# EAGLE design PT08 (EAGLE 6.6.0)

## Sheet 1 of 2
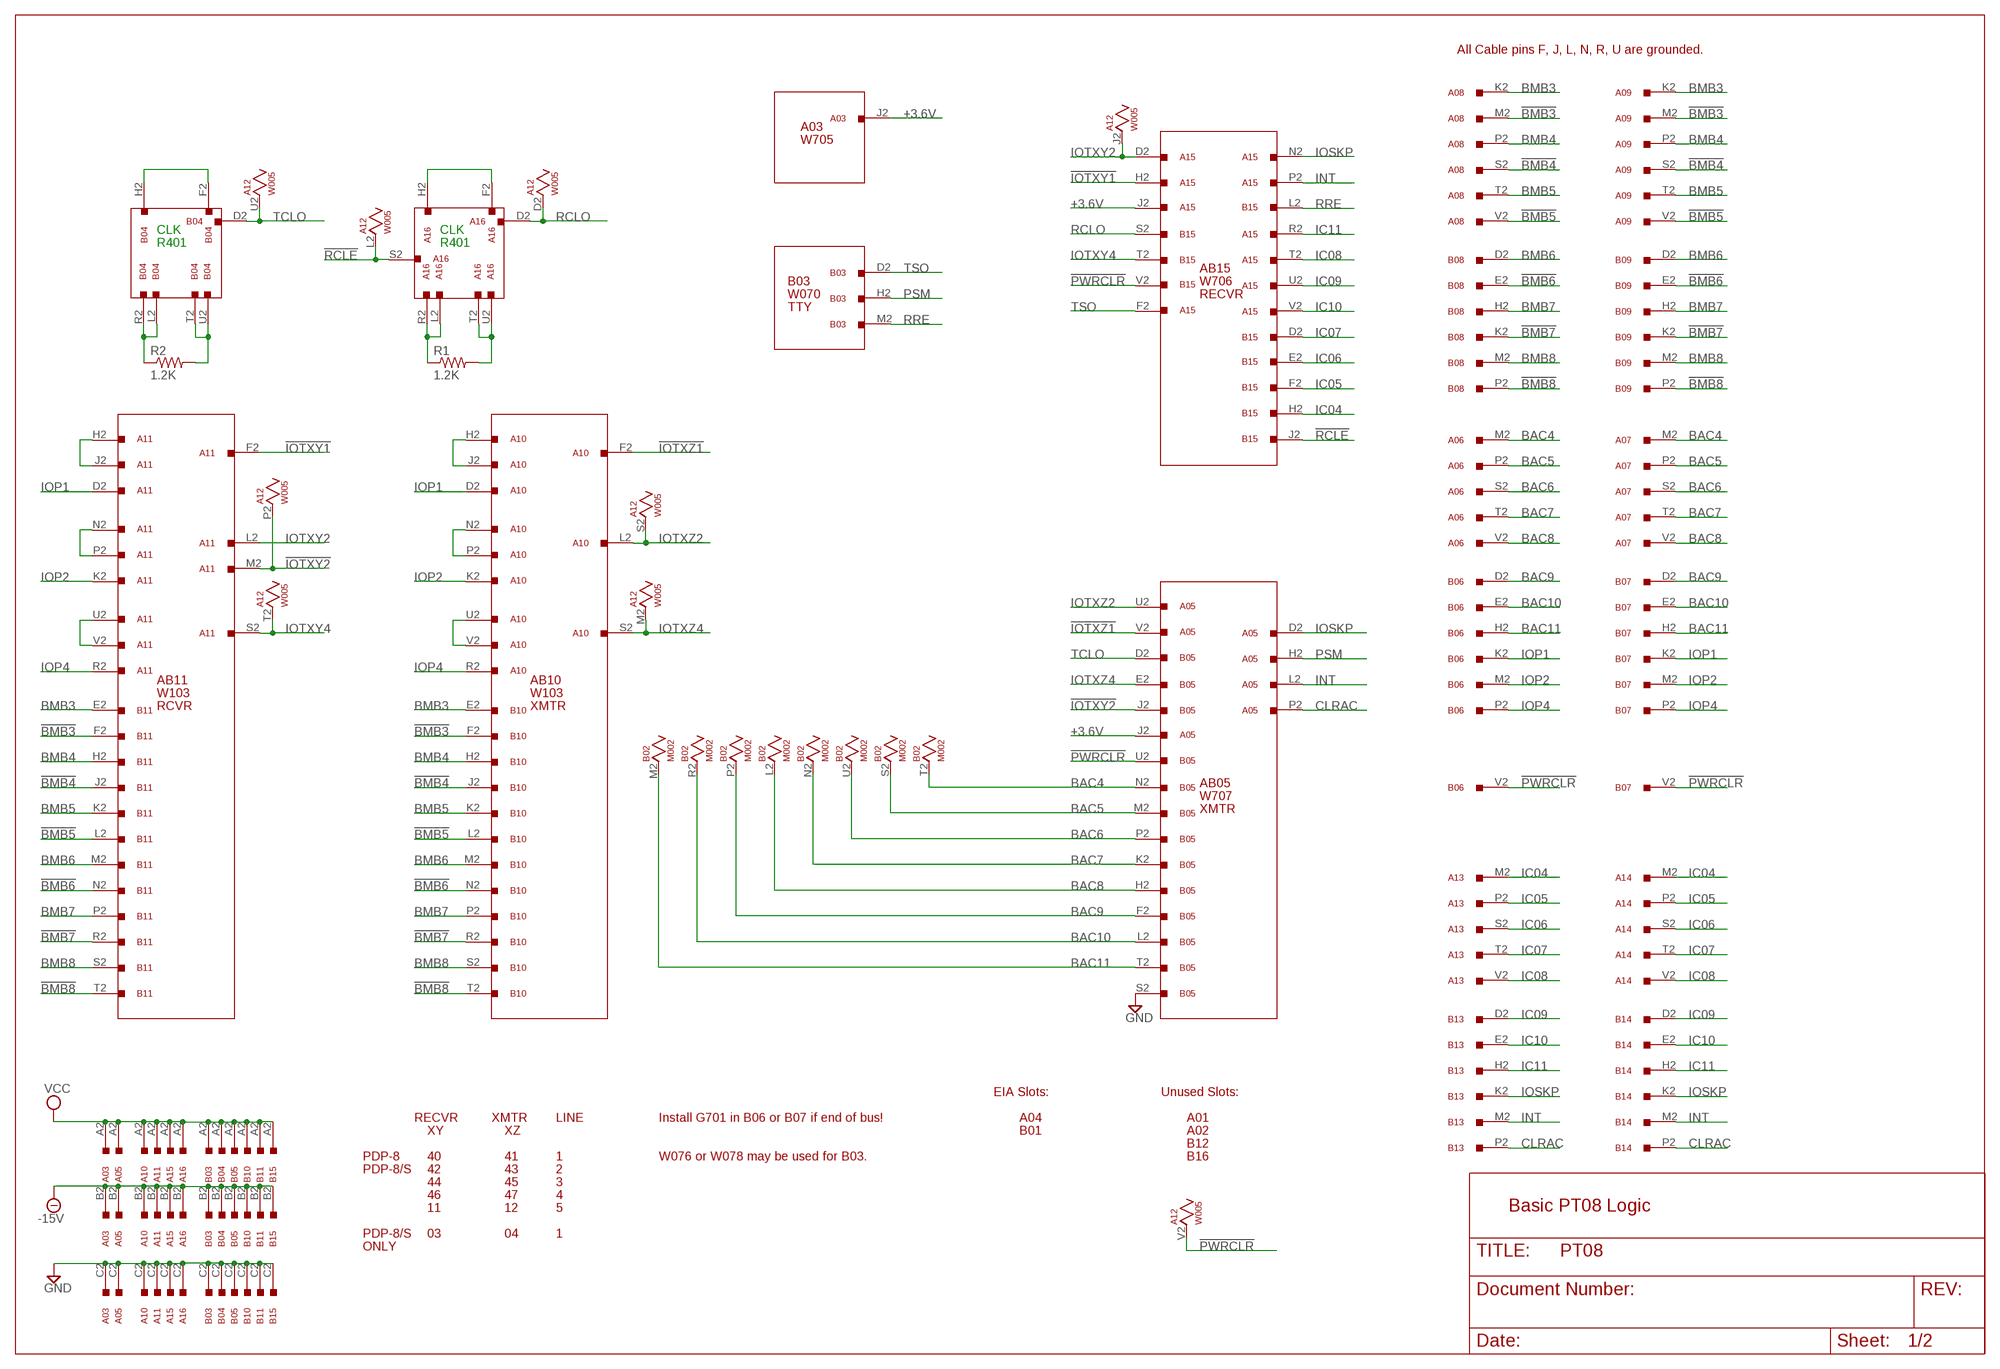
[diagram p0: schematic, sheet 1]

### Parts
A01  H807  [H807]
A02  H807  [H807]
A03  W705  W023  [H807]
A05  W707  W023  [H807]
A06  W011  [H807]
A07  W011  [H807]
A08  W011  [H807]
A09  W011  [H807]
A10  W103  W023  [H807]
A11  W103  W023  [H807]
A12  W005  [H807]
A13  W011  [H807]
A14  W011  [H807]
A15  W706  W023  [H807]
A16  R401  W023  [H807]
B02  M002  [H807]
B03  W076  W023  [H807]
B04  R401  W023  [H807]
B05  W707  W023  [H807]
B06  W011  [H807]
B07  W011  [H807]
B08  W011  [H807]
B09  W011  [H807]
B10  W103  W023  [H807]
B11  W103  W023  [H807]
B12  H807  [H807]
B13  W011  [H807]
B14  W011  [H807]
B15  W706  W023  [H807]
B16  H807  [H807]
R1  1.2K  R-US_0207/10  [0207/10]
R2  1.2K  R-US_0207/10  [0207/10]

### Nets
!BMB3: A08.M2 A09.M2 B10.F2 B11.F2
!BMB4: A08.S2 A09.S2 B10.J2 B11.J2
!BMB5: A08.V2 A09.V2 B10.L2 B11.L2
!BMB6: B08.E2 B09.E2 B10.N2 B11.N2
!BMB7: B08.K2 B09.K2 B10.R2 B11.R2
!BMB8: B08.P2 B09.P2 B10.T2 B11.T2
!IOTXY1: A11.F2 A15.H2
!IOTXY2: A11.M2 A12.P2 B05.J2
!IOTXZ1: A05.V2 A10.F2
!PWRCLR: A12.V2 B05.U2 B06.V2 B07.V2 B15.V2
!RCLE: A12.L2 A16.S2 B15.J2
+3.6V: A03.J2 A05.J2 A15.J2
-15V [Power]: A03.B2 A05.B2 A10.B2 A11.B2 A15.B2 A16.B2 B03.B2 B04.B2 B05.B2 B10.B2 B11.B2 B15.B2 ; also sheet 2
BAC4: A06.M2 A07.M2 B02.T2 B05.N2
BAC5: A06.P2 A07.P2 B02.S2 B05.M2
BAC6: A06.S2 A07.S2 B02.U2 B05.P2
BAC7: A06.T2 A07.T2 B02.N2 B05.K2
BAC8: A06.V2 A07.V2 B02.L2 B05.H2
BAC9: B02.P2 B05.F2 B06.D2 B07.D2
BAC10: B02.R2 B05.L2 B06.E2 B07.E2
BAC11: B02.M2 B05.T2 B06.H2 B07.H2
BMB3: A08.K2 A09.K2 B10.E2 B11.E2
BMB4: A08.P2 A09.P2 B10.H2 B11.H2
BMB5: A08.T2 A09.T2 B10.K2 B11.K2
BMB6: B08.D2 B09.D2 B10.M2 B11.M2
BMB7: B08.H2 B09.H2 B10.P2 B11.P2
BMB8: B08.M2 B09.M2 B10.S2 B11.S2
CLRAC: A05.P2 B13.P2 B14.P2
GND [Power]: A03.C2 A05.C2 A10.C2 A11.C2 A15.C2 A16.C2 B03.C2 B04.C2 B05.C2 B05.S2 B10.C2 B11.C2 B15.C2 ; also sheet 2
IC04: A13.M2 A14.M2 B15.H2
IC05: A13.P2 A14.P2 B15.F2
IC06: A13.S2 A14.S2 B15.E2
IC07: A13.T2 A14.T2 B15.D2
IC08: A13.V2 A14.V2 A15.T2
IC09: A15.U2 B13.D2 B14.D2
IC10: A15.V2 B13.E2 B14.E2
IC11: A15.R2 B13.H2 B14.H2
INT: A05.L2 A15.P2 B13.M2 B14.M2
IOP1: A10.D2 A11.D2 B06.K2 B07.K2
IOP2: A10.K2 A11.K2 B06.M2 B07.M2
IOP4: A10.R2 A11.R2 B06.P2 B07.P2
IOSKP: A05.D2 A15.N2 B13.K2 B14.K2
IOTXY2: A11.L2 A12.J2 A15.D2
IOTXY4: A11.S2 A12.T2 B15.T2
IOTXZ2: A05.U2 A10.L2 A12.S2
IOTXZ4: A10.S2 A12.M2 B05.E2
N$1: A10.U2 A10.V2
N$2: A16.F2 A16.H2
N$3: A16.L2 A16.R2 R1.1
N$4: A16.T2 A16.U2 R1.2
N$5: A10.H2 A10.J2
N$6: B04.F2 B04.H2
N$7: B04.L2 B04.R2 R2.1
N$8: B04.T2 B04.U2 R2.2
N$9: A11.U2 A11.V2
N$10: A11.H2 A11.J2
N$11: A10.N2 A10.P2
N$12: A11.N2 A11.P2
PSM: A05.H2 B03.H2 ; also sheet 2
RCLO: A12.D2 A16.D2 B15.S2
RRE: B03.M2 B15.L2
TCLO: A12.U2 B04.D2 B05.D2
TSO: A15.F2 B03.D2 ; also sheet 2
VCC [Power]: A03.A2 A05.A2 A10.A2 A11.A2 A15.A2 A16.A2 B03.A2 B04.A2 B05.A2 B10.A2 B11.A2 B15.A2 ; also sheet 2
Unconnected: A03.D2 A03.E2 A03.F2 A03.H2 A03.K2 A03.L2 A03.M2 A03.N2 A03.P2 A03.R2 A03.S2 A03.T2 A03.U2 A03.V2 A05.E2 A05.F2 A05.K2 A05.M2 A05.N2 A05.R2 A05.S2 A05.T2 A06.D2 A06.E2 A06.H2 A06.K2 A07.D2 A07.E2 A07.H2 A07.K2 A08.D2 A08.E2 A08.H2 A09.D2 A09.E2 A09.H2 A10.E2 A10.M2 A10.T2 A11.E2 A11.T2 A12.E2 A12.F2 A12.H2 A12.K2 A12.N2 A12.R2 A13.D2 A13.E2 A13.H2 A13.K2 A14.D2 A14.E2 A14.H2 A14.K2 A15.E2 A15.K2 A15.L2 A15.M2 A15.S2 A16.E2 A16.J2 A16.K2 A16.M2 A16.N2 A16.P2 A16.V2 B02.F2 B02.H2 B02.J2 B02.K2 B02.V2 B03.F2 B03.J2 B03.L2 B03.N2 B03.R2 B03.S2 B03.T2 B03.U2 B03.V2 B04.E2 B04.J2 B04.K2 B04.M2 B04.N2 B04.P2 B04.S2 B04.V2 B05.R2 B05.V2 B06.S2 B06.T2 B07.S2 B07.T2 B08.S2 B08.T2 B08.V2 B09.S2 B09.T2 B09.V2 B10.D2 B10.U2 B10.V2 B11.D2 B11.U2 B11.V2 B13.S2 B13.T2 B13.V2 B14.S2 B14.T2 B14.V2 B15.K2 B15.M2 B15.N2 B15.P2 B15.R2 B15.U2

### Notes on the sheet
- All Cable pins F, J, L, N, R, U are grounded.
- A03
- W705
- CLK | CLK
- R401 | R401
- AB15
- B03 | W706
- W070 | RECVR
- TTY
- AB11 | AB10
- W103 | W103
- RCVR | XMTR
- AB05
- W707
- XMTR
- EIA Slots: | Unused Slots:
- RECVR | XMTR | LINE | Install G701 in B06 or B07 if end of bus! | A04
- XY | XZ | B01
- PDP-8 | 40 | 41 | 1 | W076 or W078 may be used for B03.
- PDP-8/S | 42 | 43 | 2
- 44 | 45 | 3
- 46 | 47 | 4
- 11 | 12 | 5 | Basic PT08 Logic
- PDP-8/S | 03 | 04 | 1
- ONLY

## Sheet 2 of 2
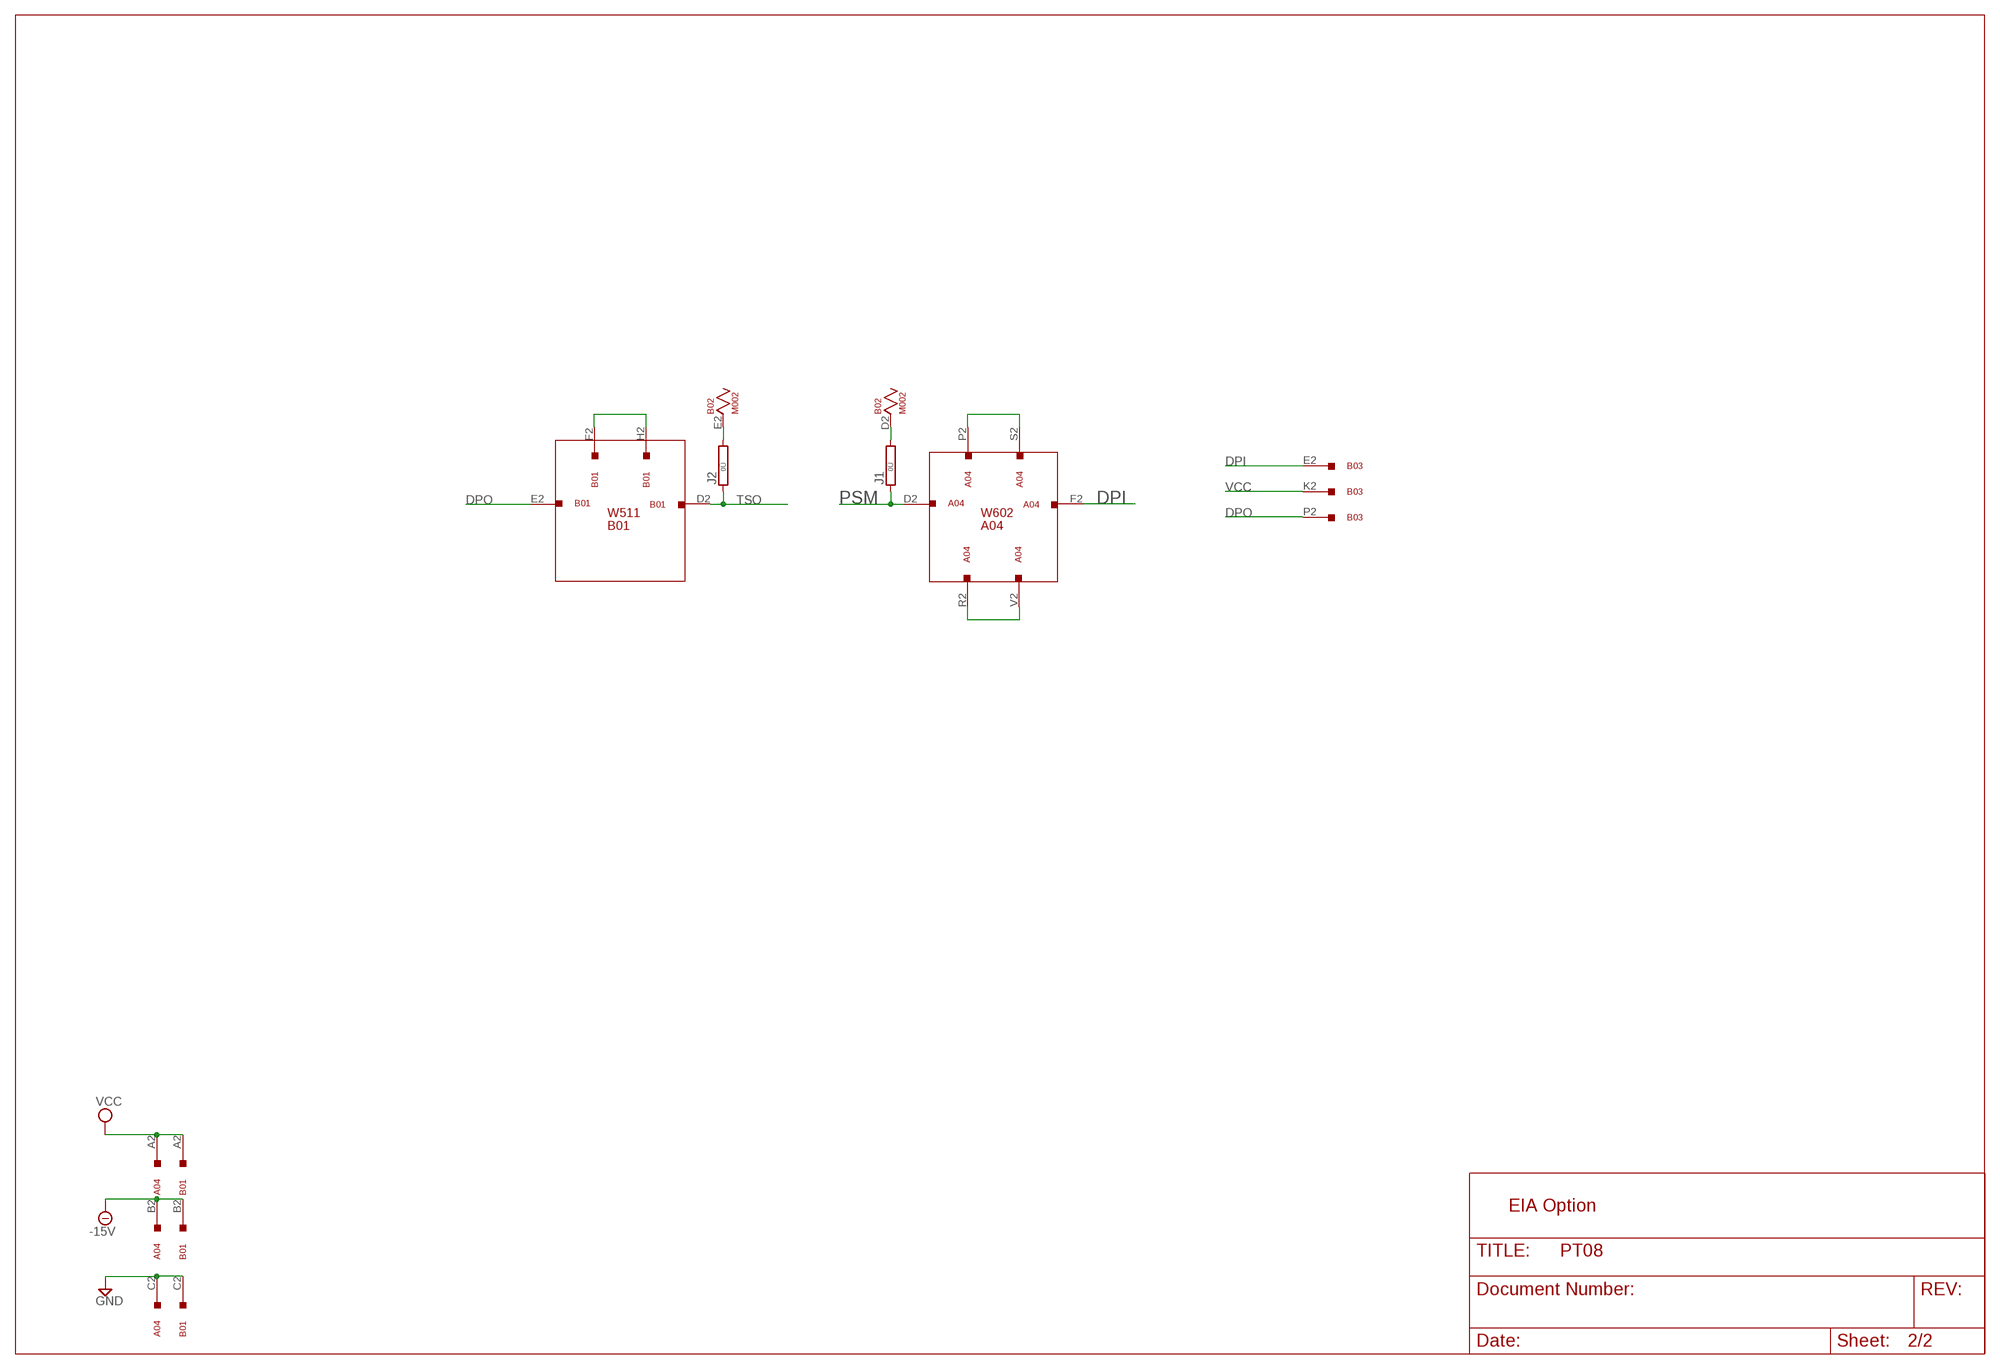
[diagram p1: schematic, sheet 2]

### Parts
A04  W602  W023  [H807]
B01  W511  W023  [H807]
J1  0R  [0R/10]
J2  0R  [0R/10]

### Nets
-15V [Power]: A04.B2 B01.B2 ; also sheet 1
DPI: A04.F2 B03.E2
DPO: B01.E2 B03.P2
GND [Power]: A04.C2 B01.C2 ; also sheet 1
N$13: A04.P2 A04.S2
N$14: A04.R2 A04.V2
N$15: B02.D2 J1.2
N$16: B01.F2 B01.H2
N$17: B02.E2 J2.2
PSM: A04.D2 J1.1 ; also sheet 1
TSO: B01.D2 J2.1 ; also sheet 1
VCC [Power]: A04.A2 B01.A2 B03.K2 ; also sheet 1
Unconnected: A04.E2 A04.H2 A04.J2 A04.K2 A04.L2 A04.M2 A04.N2 A04.T2 A04.U2 B01.J2 B01.K2 B01.L2 B01.M2 B01.N2 B01.P2 B01.R2 B01.S2 B01.T2 B01.U2 B01.V2

### Notes on the sheet
- W511 | W602
- B01 | A04
- EIA Option

## Power pins joined to a net without a drawn wire
-15V: A12.B2(-15V)
GND: A06.C2 A06.F2 A06.J2 A06.L2 A06.N2 A06.R2 A06.U2 A07.C2 A07.F2 A07.J2 A07.L2 A07.N2 A07.R2 A07.U2 A08.C2 A08.F2 A08.J2 A08.L2 A08.N2 A08.R2 A08.U2 A09.C2 A09.F2 A09.J2 A09.L2 A09.N2 A09.R2 A09.U2 A12.C2(GND) A13.C2 A13.F2 A13.J2 A13.L2 A13.N2 A13.R2 A13.U2 A14.C2 A14.F2 A14.J2 A14.L2 A14.N2 A14.R2 A14.U2 B02.C2(GND) B06.C2 B06.F2 B06.J2 B06.L2 B06.N2 B06.R2 B06.U2 B07.C2 B07.F2 B07.J2 B07.L2 B07.N2 B07.R2 B07.U2 B08.C2 B08.F2 B08.J2 B08.L2 B08.N2 B08.R2 B08.U2 B09.C2 B09.F2 B09.J2 B09.L2 B09.N2 B09.R2 B09.U2 B13.C2 B13.F2 B13.J2 B13.L2 B13.N2 B13.R2 B13.U2 B14.C2 B14.F2 B14.J2 B14.L2 B14.N2 B14.R2 B14.U2
VCC: A12.A2(VCC) B02.A2(VCC)

## Library data of the parts
A01 A02 B12 B16 = dec-m:H807: Empty card slot
A03-A05 A10 A11 A15 A16 B01 B03-B05 B10 B11 B15 = dec-m:W023: One-sided 18 pin connector/cable.
A06-A09 A13 A14 B06-B09 B13 B14 = dec-m:W011: One-sided 9 pin connector/cable with grounds (Negibus).
A12 = dec-m:W005: 15 Clamped Loads
B02 = dec-m:M002: 15 Clamped Loads
J1 J2 = jumper:0R: Bridge 0R 10mm
R1 R2 = rcl:R-US_: RESISTOR, American symbol

## Net classes
1 Power: width 0.508 mm

## Board
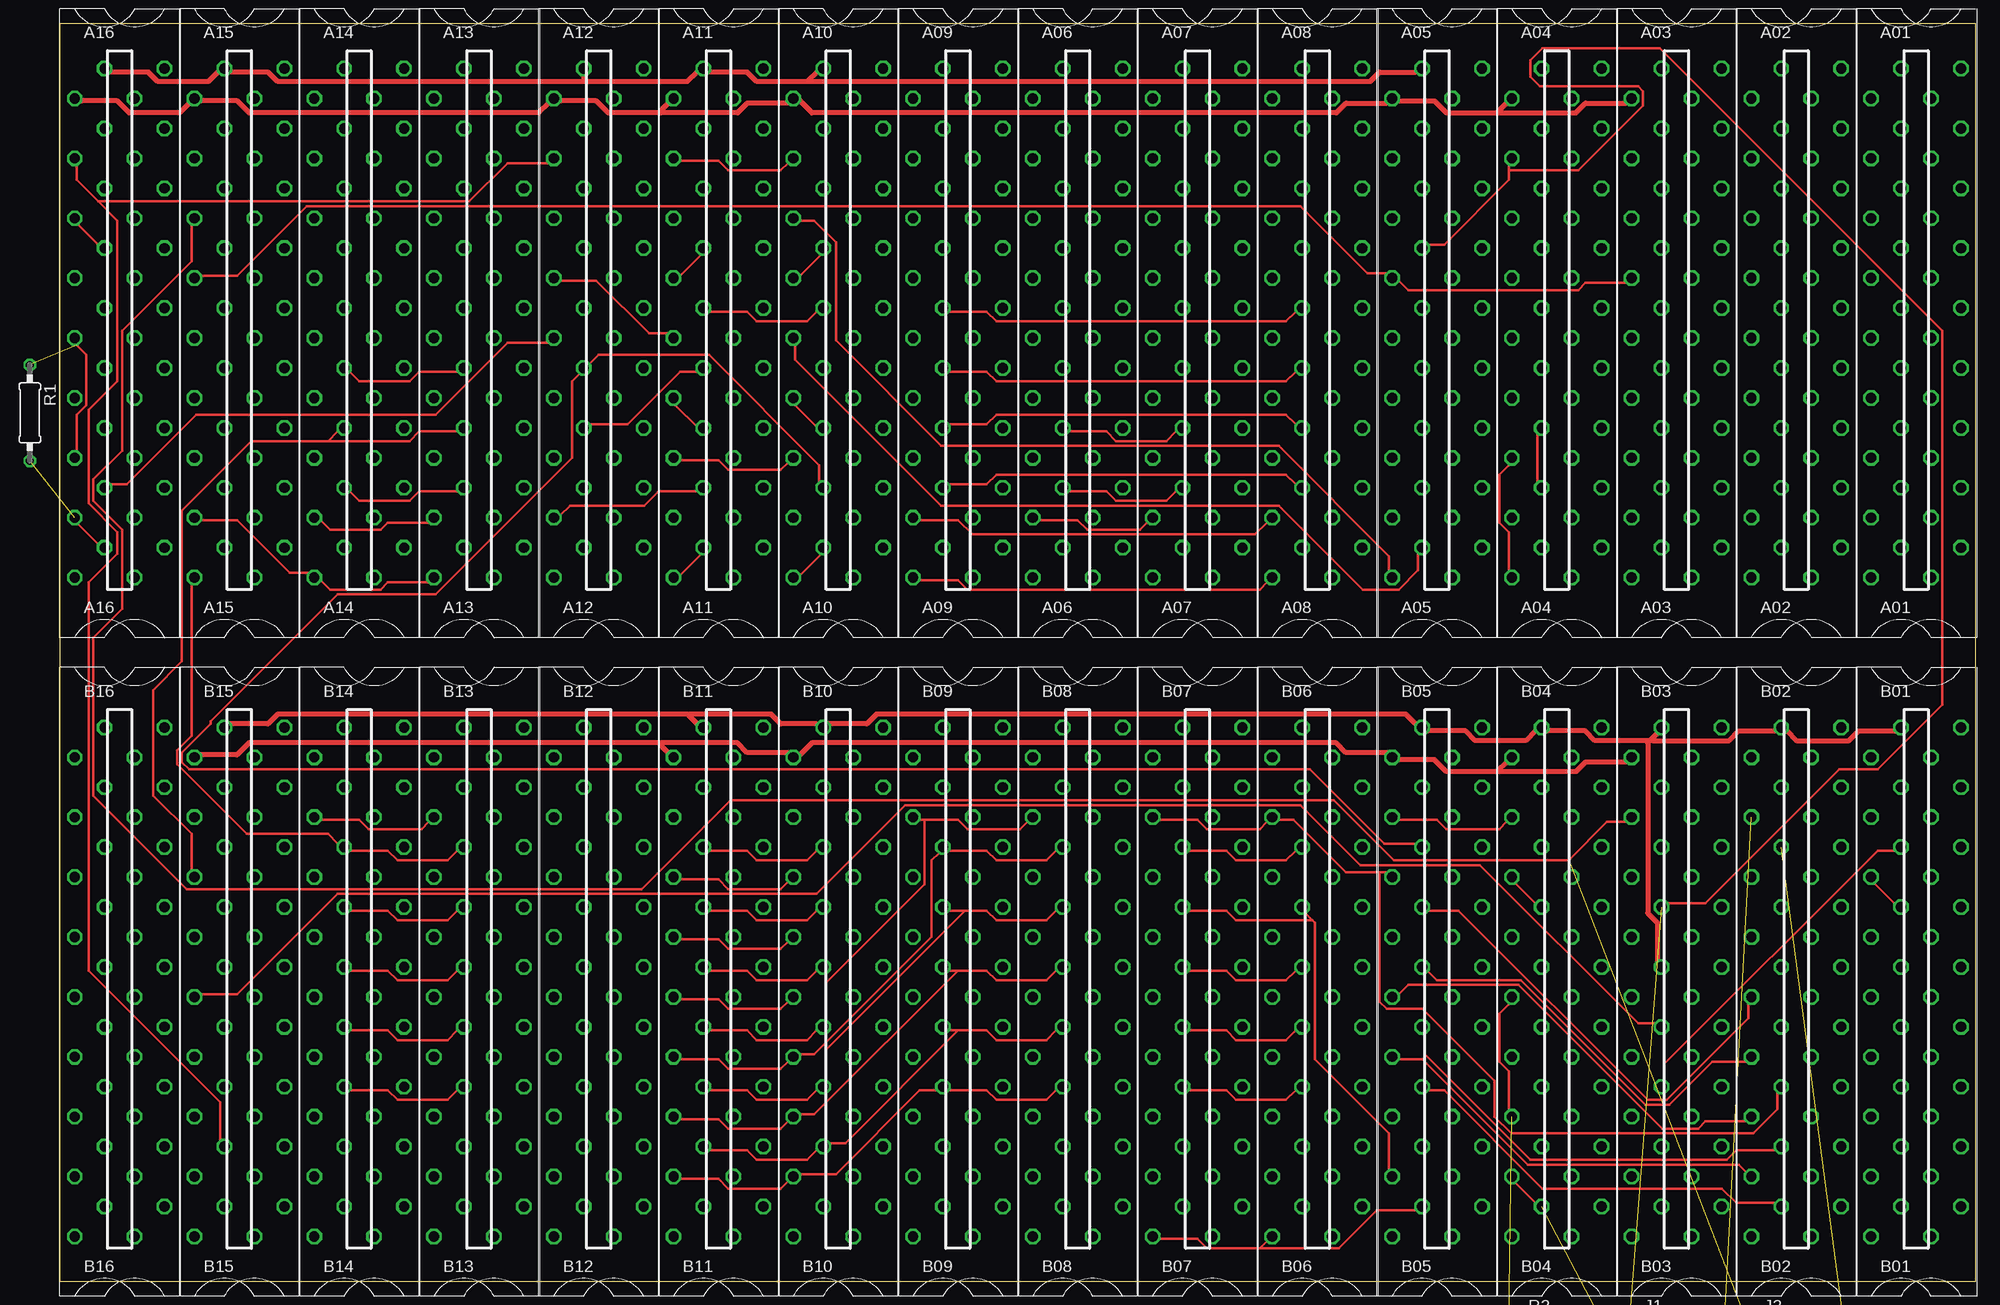
[diagram p2: board, top side]
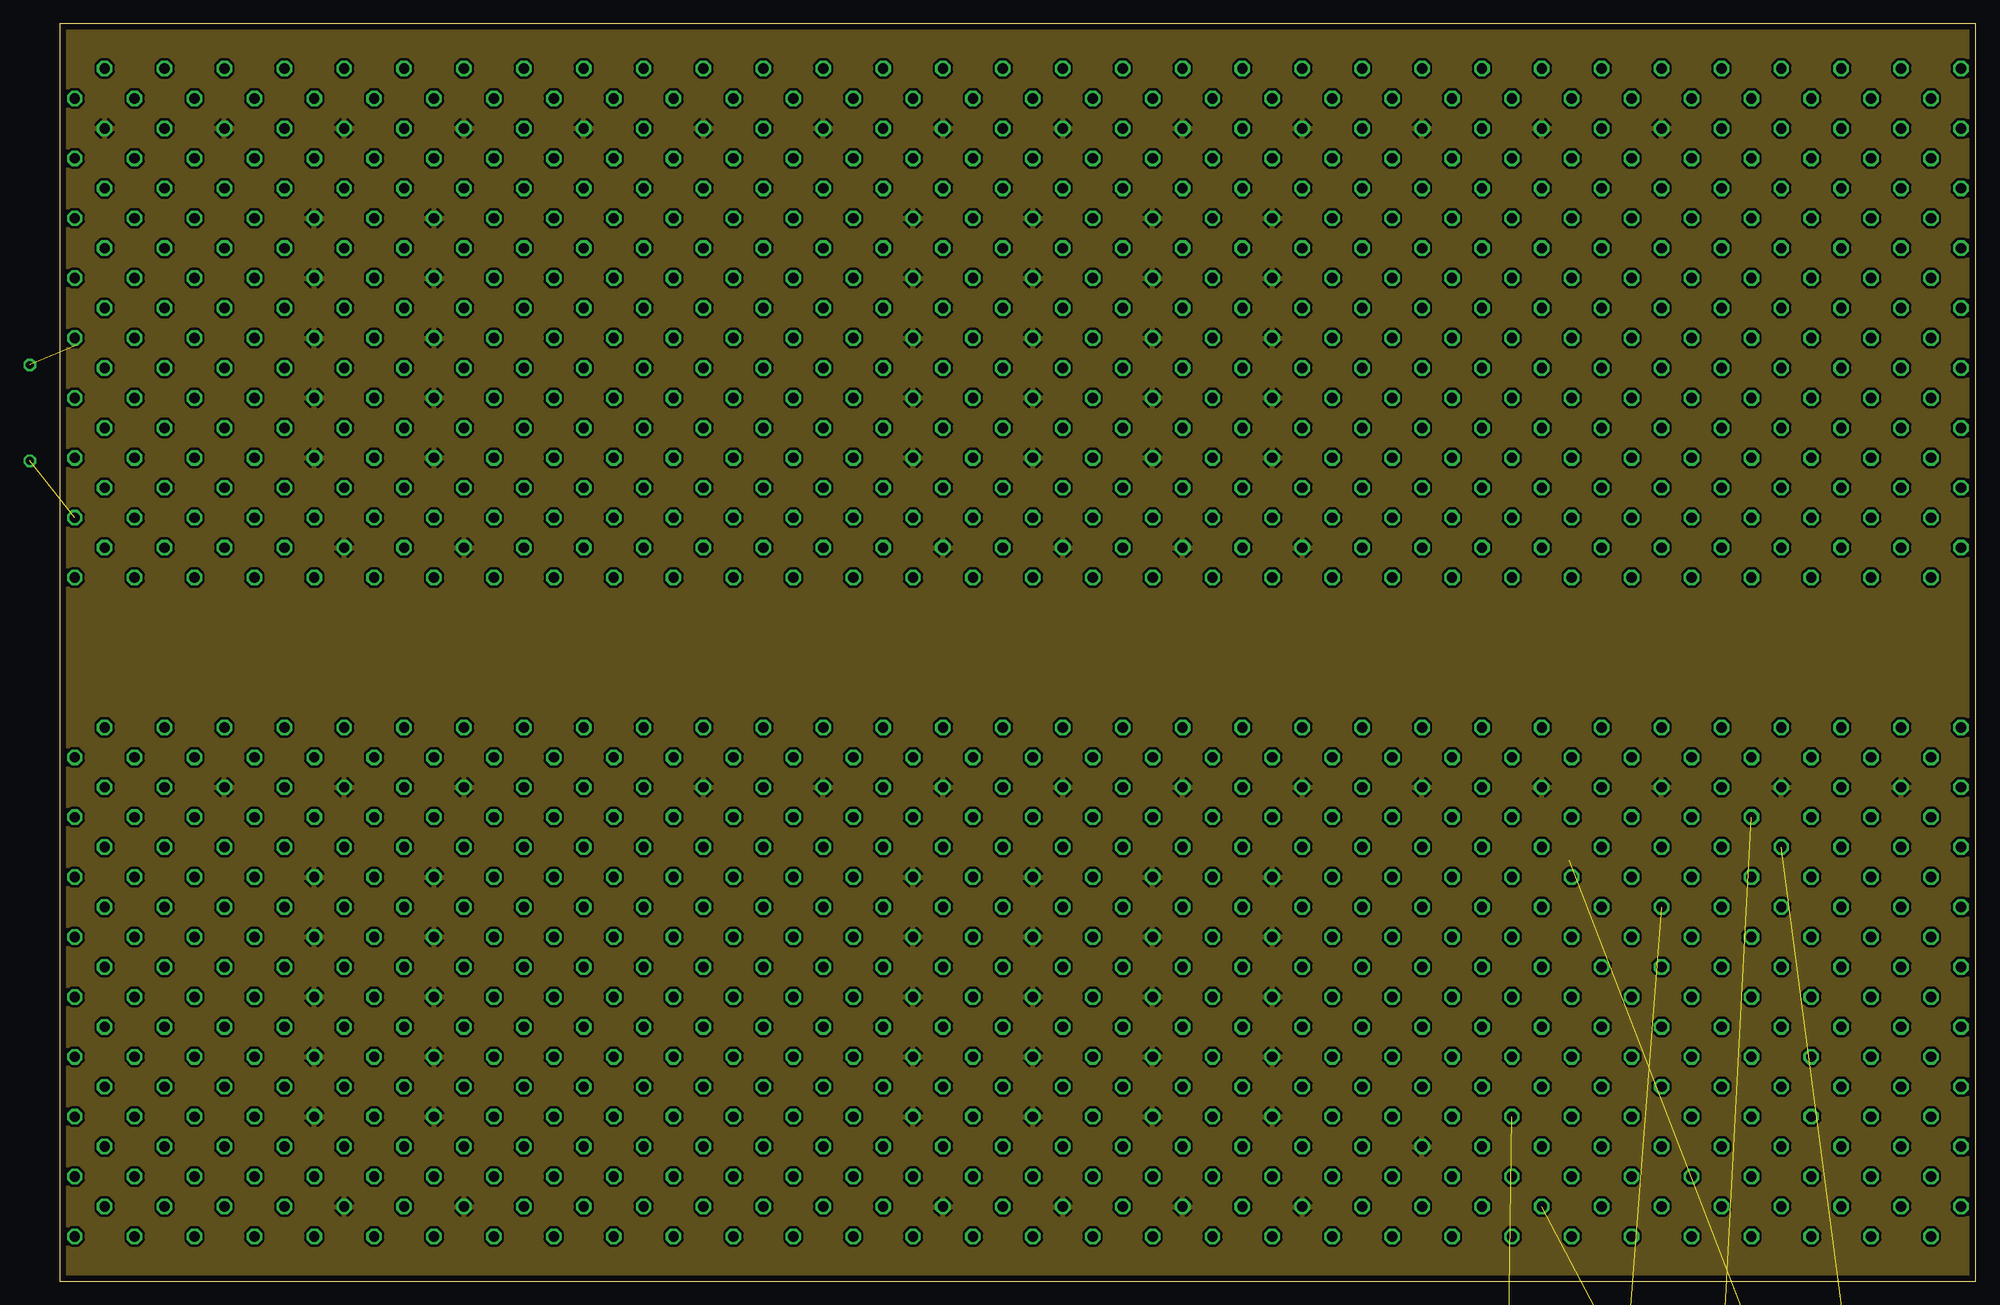
[diagram p3: board, inner layer GND$]
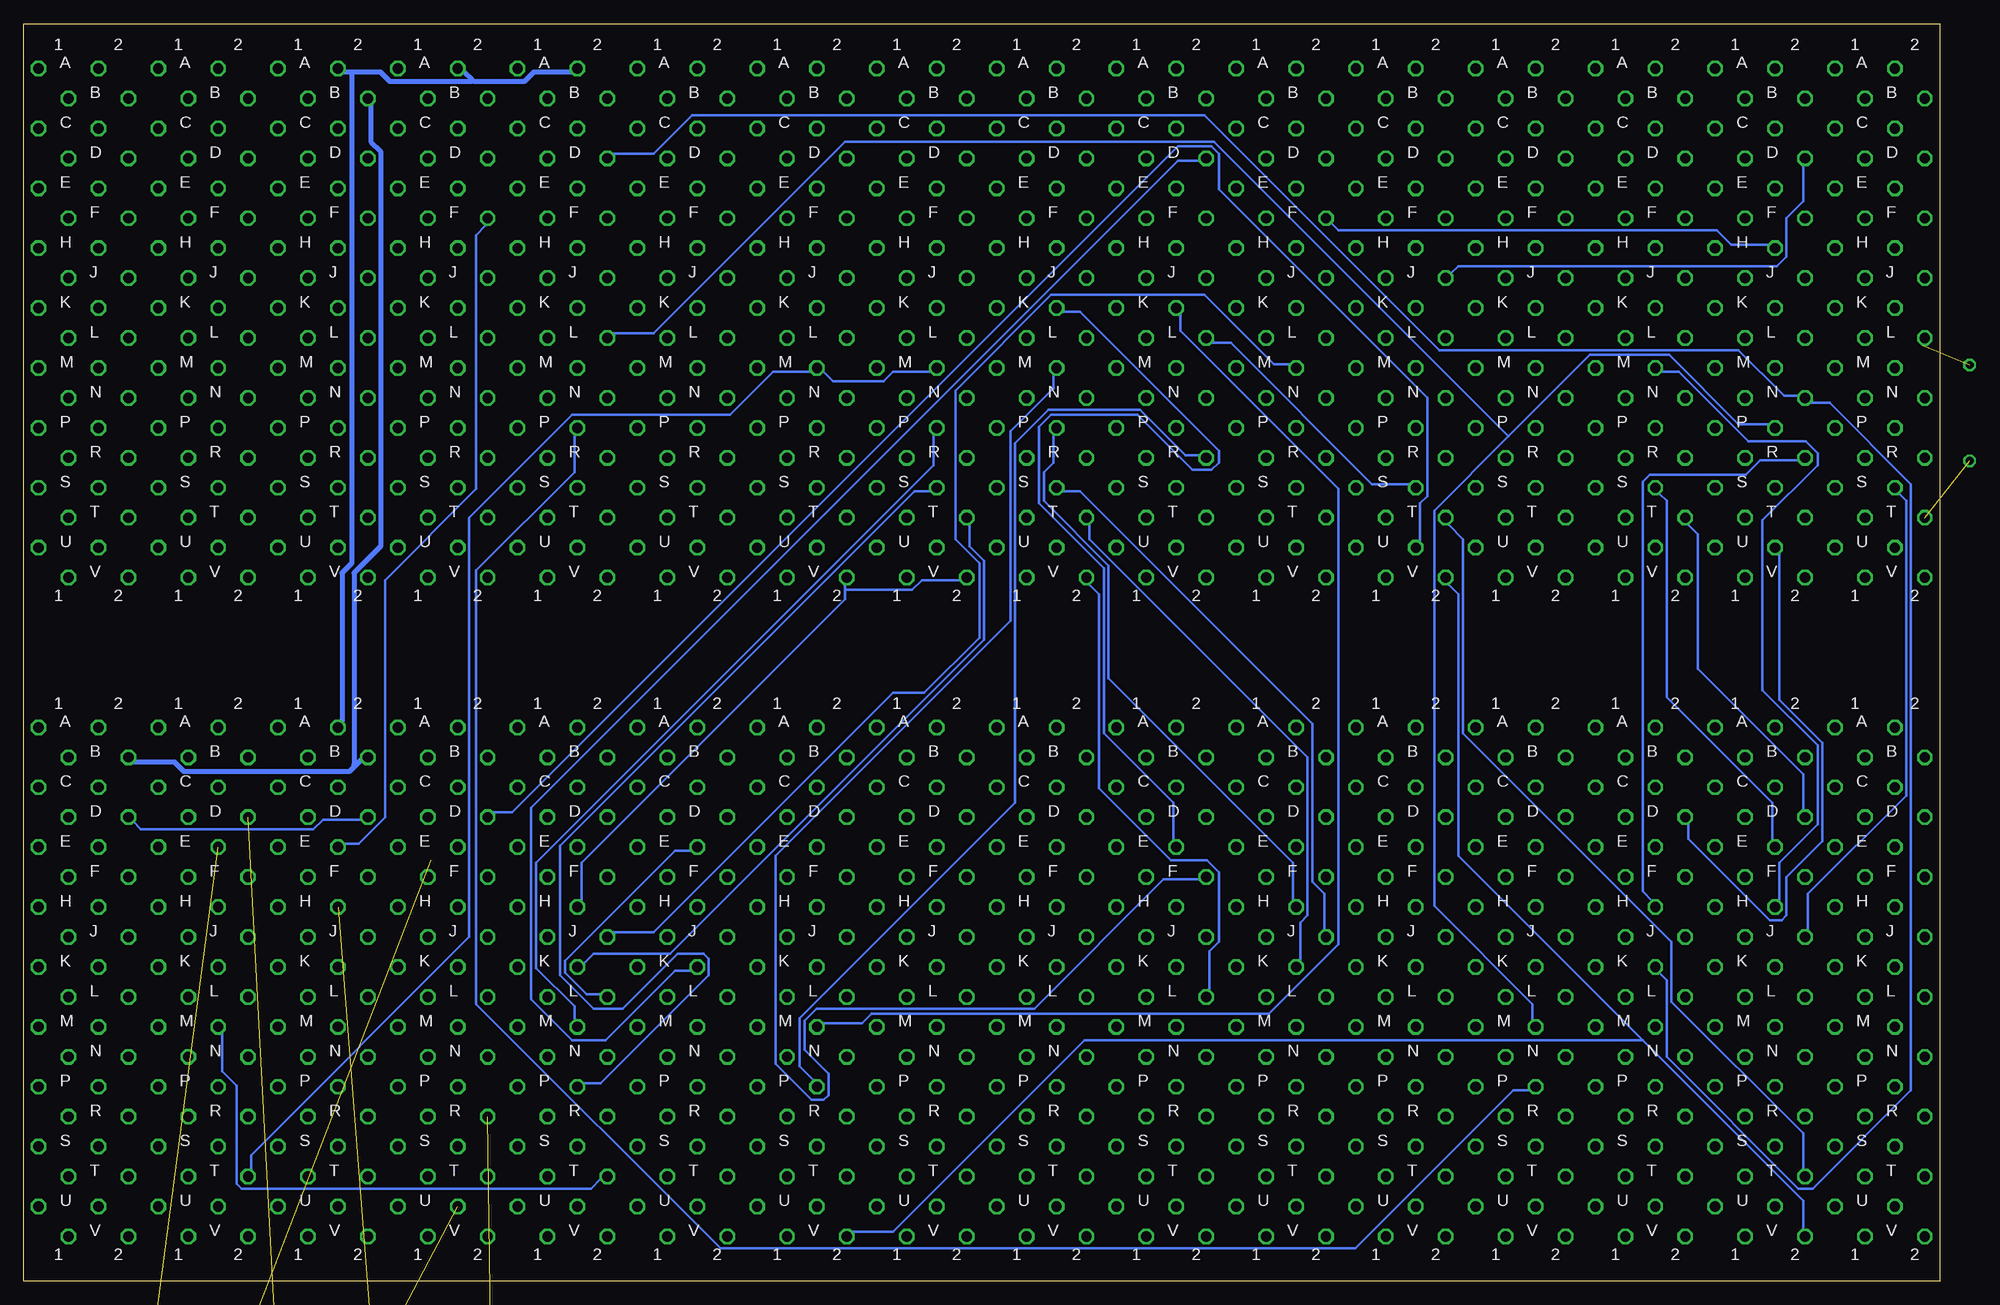
[diagram p4: board, bottom side, seen from below]

Size 203.2 x 133.35 mm. Coordinates in mm from the lower left corner, seen from the top.
Outline: 0,0 203.2,0 203.2,133.35 0,133.35 0,0
Copper layers (1*2*16): Top 0.035mm / dielectric 1.5mm / GND$ 0.035mm / dielectric 0.15mm / Bottom 0.035mm
Design rules "10mils *": minimum track width 10mil, minimum drill 24mil, track to track 10mil, track to pad 10mil, pad to pad 10mil, via to via 10mil, smd to smd 10mil, copper to edge 25mil, drill to drill 10mil, minimum pad ring 10mil, minimum via ring 8mil, stop-mask expansion 0mil, vias tented up to drill 0mil, thermal gap 10mil

### Footprints (pad centres in the part's own frame; a part is rotated, then mirrored left to right if it is on the bottom)
H807 = drill 1.092 octagon: A1 4.763,28.575; A2 -1.587,28.575; B1 1.587,25.4; B2 -4.763,25.4; C1 4.763,22.225; C2 -1.587,22.225; D1 1.587,19.05; D2 -4.763,19.05; E1 4.763,15.875; E2 -1.587,15.875; F1 1.587,12.7; F2 -4.763,12.7; H1 4.763,9.525; H2 -1.587,9.525; J1 1.587,6.35; J2 -4.763,6.35; K1 4.763,3.175; K2 -1.587,3.175; L1 1.587,0; L2 -4.763,0; M1 4.763,-3.175; M2 -1.587,-3.175; N1 1.587,-6.35; N2 -4.763,-6.35; P1 4.763,-9.525; P2 -1.587,-9.525; R1 1.587,-12.7; R2 -4.763,-12.7; S1 4.763,-15.875; S2 -1.587,-15.875; T1 1.587,-19.05; T2 -4.763,-19.05; U1 4.763,-22.225; U2 -1.587,-22.225; V1 1.587,-25.4; V2 -4.763,-25.4
0R/10 = drill 0.813 pad 1.6 octagon: 1 -5.08,0; 2 5.08,0
0207/10 = drill 0.813 octagon: 1 -5.08,0; 2 5.08,0

### Placement (x,y rotation side)
A01  196.85,100.01 0 top
A02  184.15,100.01 0 top
A03  171.45,100.01 0 top
A04  158.75,100.01 0 top
A05  146.05,100.01 0 top
A06  107.95,100.01 0 top
A07  120.65,100.01 0 top
A08  133.35,100.01 0 top
A09  95.25,100.01 0 top
A10  82.55,100.01 0 top
A11  69.85,100.01 0 top
A12  57.15,100.01 0 top
A13  44.45,100.01 0 top
A14  31.75,100.01 0 top
A15  19.05,100.01 0 top
A16  6.35,100.01 0 top
B01  196.85,30.16 0 top
B02  184.15,30.16 0 top
B03  171.45,30.16 0 top
B04  158.75,30.16 0 top
B05  146.05,30.16 0 top
B06  133.35,30.16 0 top
B07  120.65,30.16 0 top
B08  107.95,30.16 0 top
B09  95.25,30.16 0 top
B10  82.55,30.16 0 top
B11  69.85,30.16 0 top
B12  57.15,30.16 0 top
B13  44.45,30.16 0 top
B14  31.75,30.16 0 top
B15  19.05,30.16 0 top
B16  6.35,30.16 0 top
J1  171.45,-4.76 0 top  (outside the outline)
J2  184.15,-4.76 0 top  (outside the outline)
R1  -3.17,92.07 270 top  (outside the outline)
R2  158.75,-4.76 0 top  (outside the outline)

### Tracks (layer width: path | path; a pad name or v marks a point on that pad's centre or on a via)
!BMB3
  Top 0.254: B11.F2 65.79,42.61 69.85,42.61 70.87,41.59 76.45,41.59 77.22,42.35 B10.F2 | A09.M2 94.23,96.46 98.3,96.46 99.31,95.44 130.05,95.44 131.06,96.46 A08.M2
  Bottom 0.254: B10.F2 78.49,42.61 82.3,42.61 96.01,28.89 119.13,28.89 120.4,27.62 120.4,24.57 117.86,22.03 117.86,19.75 118.36,19.24 119.63,19.24 123.44,23.05 123.44,45.15 98.55,70.04 98.55,90.11 93.98,94.68 93.98,96.2 A09.M2
!BMB4
  Top 0.254: B11.J2 65.79,36.26 69.85,36.26 70.87,35.24 76.45,35.24 77.22,36 B10.J2 | A09.S2 94.23,84.52 98.3,84.52 99.31,85.53 130.05,85.53 131.06,84.52 A08.S2
  Bottom 0.254: B11.J2 65.28,37.27 65.28,41.08 66.55,42.35 66.55,59.12 91.19,83.76 92.96,83.76 A09.S2
!BMB5
  Top 0.254: B11.L2 65.79,29.91 69.85,29.91 70.87,28.89 76.45,28.89 77.22,29.65 B10.L2 | A09.V2 91.19,74.36 95.25,74.36 96.27,73.34 127.25,73.34 128.02,74.1 A08.V2
  Bottom 0.254: B10.L2 77.47,30.92 77.47,34.99 76.45,36 76.45,43.37 77.72,44.64 81.53,44.64 89.15,52.26 89.15,72.83 90.17,73.85 A09.V2
!BMB6
  Top 0.254: B11.N2 65.79,23.56 69.85,23.56 70.87,22.54 76.45,22.54 77.22,23.3 B10.N2 78.49,24.07 80.01,24.07 92.46,36.51 92.46,44.64 93.22,45.4 B09.E2 94.23,45.66 98.3,45.66 99.31,44.64 104.65,44.64 105.66,45.66 B08.E2
!BMB7
  Top 0.254: B11.R2 65.79,17.21 69.85,17.21 70.87,16.19 76.45,16.19 77.22,16.95 B10.R2 78.49,17.72 80.01,17.72 95.25,32.96 | 95.25,32.96 98.3,32.96 99.31,31.94 104.65,31.94 105.66,32.96 B08.K2 | 95.25,32.96 94.23,32.96 B09.K2
!BMB8
  Top 0.254: B11.T2 65.79,10.86 69.85,10.86 70.87,9.84 76.45,9.84 77.22,10.6 B10.T2 78.49,11.37 82.3,11.37 91.19,20.26 92.96,20.26 B09.P2 94.23,20.26 98.3,20.26 99.31,19.24 104.65,19.24 105.66,20.26 B08.P2
!IOTXY1
  Bottom 0.254: A15.H2 18.03,109.92 22.1,109.92 23.62,111.44 63.75,111.44 64.52,112.2 A11.F2
!IOTXY2
  Top 0.254: A12.P2 56.13,90.87 60.2,90.87 65.79,96.46 67.56,96.46 A11.M2
  Bottom 0.254: B05.J2 140.72,37.02 136.4,37.02 111,62.42 107.7,62.42 101.85,68.26 101.85,76.14 104.39,78.68 104.39,94.42 94.23,104.58 77.98,104.58 70.61,97.22 68.83,97.22 A11.M2
!IOTXZ1
  Top 0.254: A05.V2 140.97,75.37 140.97,76.9 129.29,88.58 93.47,88.58 82.3,99.76 82.3,110.17 80.01,112.46 78.49,112.46 A10.F2
!PWRCLR
  Top 0.254: 127.25,3.49 121.67,3.49 120.65,4.51 116.59,4.51 B07.V2 | 127.25,3.49 128.02,4.25 B06.V2 | 127.25,3.49 135.64,3.49 139.7,7.56 143.76,7.56 B05.U2
  Bottom 0.254: 31.5,25.59 51.05,45.15 51.05,72.83 52.07,73.85 A12.V2 | 31.5,25.59 14.48,8.57 14.48,5.52 B15.V2 | 31.5,25.59 90.68,25.59 111,5.27 115.32,5.27 B07.V2
!RCLE
  Top 0.254: A12.L2 51.82,99.5 47.5,99.5 39.88,91.88 14.48,91.88 7.11,84.52 5.33,84.52 A16.S2
  Bottom 0.254: B15.J2 13.97,37.27 13.97,41.08 3.56,51.5 3.56,82.74 4.32,83.5 A16.S2
+3.6V
  Top 0.254: A15.J2 14.99,106.62 18.8,106.62 26.16,113.98 131.57,113.98 138.68,106.87 140.72,106.87 A05.J2 141.99,106.11 143,105.09 161.04,105.09 161.8,105.85 166.12,105.85 A03.J2
-15V
  Top 0.508: 152.53,124.02 153.42,124.9 A04.B2 | 152.53,124.02 152.4,123.89 147.07,123.89 145.8,125.16 141.99,125.16 A05.B2 140.72,124.9 136.4,124.9 135.38,123.89 79.76,123.89 78.49,125.16 A10.B2 77.22,124.9 72.9,124.9 71.88,123.89 63.75,123.89 63.63,124.02 | A03.B2 166.12,124.9 161.8,124.9 160.78,123.89 152.65,123.89 152.53,124.02 | A16.B2 2.29,125.16 6.1,125.16 7.37,123.89 12.7,123.89 13.72,124.9 A15.B2 14.99,125.16 18.8,125.16 20.07,123.89 50.8,123.89 51.82,124.9 A12.B2 53.09,125.16 56.9,125.16 58.17,123.89 63.5,123.89 63.63,124.02 | 63.63,124.02 64.52,124.9 A11.B2 | 152.53,54.17 153.42,55.05 B04.B2 | 152.53,54.17 152.4,54.04 147.07,54.04 145.8,55.31 141.99,55.31 B05.B2 140.72,56.07 136.4,56.07 135.38,57.09 79.76,57.09 78.49,55.82 B10.B2 77.22,56.07 72.9,56.07 71.88,57.09 63.75,57.09 63.63,56.96 | B03.B2 166.12,55.05 161.8,55.05 160.78,54.04 152.65,54.04 152.53,54.17 | 63.63,56.96 64.52,56.07 B11.B2 | 63.63,56.96 63.5,57.09 20.07,57.09 18.8,55.82 14.99,55.82 B15.B2
  Bottom 0.508: 168.02,54.67 167.39,55.31 B03.B2 | 168.02,54.67 168.66,54.04 186.18,54.04 187.2,55.05 191.52,55.05 B01.B2 | A03.B2 166.37,124.65 166.37,120.84 165.35,119.82 165.35,77.91 168.15,75.12 168.15,54.8 168.02,54.67
BAC4
  Top 0.254: B05.N2 141.99,23.56 144.53,23.56 155.7,12.38 178.05,12.38 178.82,11.62 B02.T2
  Bottom 0.254: A06.M2 106.93,96.46 111,96.46 112.01,95.44 117.35,95.44 118.36,96.46 A07.M2 119.63,96.46 123.7,96.46 128.27,91.88 145.03,91.88 155.96,80.96 155.96,36.51 179.07,13.4 179.07,11.87 B02.T2
BAC5
  Top 0.254: A06.P2 106.93,90.11 111,90.11 112.01,89.09 117.35,89.09 118.36,90.11 A07.P2 | B02.S2 181.86,13.91 177.8,13.91 176.78,12.89 155.96,12.89 144.78,24.07 144.78,26.35 B05.M2
  Bottom 0.254: A06.P2 106.68,89.85 106.68,86.55 148.84,44.39 148.84,33.21 144.78,29.15 144.78,27.62 B05.M2
BAC6
  Top 0.254: A06.S2 106.93,83.76 111,83.76 112.01,82.74 117.35,82.74 118.36,83.76 A07.S2 | B02.U2 181.86,8.32 177.8,8.32 176.28,9.84 157.23,9.84 146.81,20.26 145.03,20.26 B05.P2
  Bottom 0.254: A06.S2 106.93,83.76 108.71,83.76 146.3,46.16 146.3,32.45 142.75,28.89 139.7,28.89 133.86,34.73 131.06,34.73 130.56,34.23 130.56,32.45 141.99,21.02 143.76,21.02 B05.P2
BAC7
  Top 0.254: A06.T2 103.89,80.71 107.95,80.71 108.97,79.69 114.55,79.69 115.32,80.45 A07.T2 | B02.N2 178.82,23.3 175.26,23.3 170.69,18.73 168.15,18.73 154.94,31.94 146.05,31.94 145.03,32.96 B05.K2
  Bottom 0.254: A06.T2 102.87,80.2 102.87,77.91 101.35,76.39 101.35,68.01 134.62,34.73 142.75,34.73 143.76,33.72 B05.K2
BAC8
  Top 0.254: B02.L2 179.07,29.4 179.07,27.88 170.43,19.24 168.4,19.24 148.34,39.31 145.03,39.31 B05.H2
  Bottom 0.254: 116.08,73.34 116.08,73.85 A07.V2 | 116.08,73.34 116.08,72.33 144.02,44.39 144.02,40.32 B05.H2 | 116.08,73.34 108.97,73.34 107.95,74.36 103.89,74.36 A06.V2
BAC9
  Top 0.254: 139.95,43.37 136.4,43.37 130.81,48.96 129.29,48.96 B06.D2 128.02,48.7 127.25,47.94 121.67,47.94 120.65,48.96 116.59,48.96 B07.D2 | 139.95,43.37 140.72,43.37 B05.F2 | 139.95,43.37 139.95,29.65 140.72,28.89 144.53,28.89 152.15,21.27 152.15,17.46 153.92,15.68 179.58,15.68 182.12,18.22 182.12,20 B02.P2
BAC10
  Top 0.254: B07.E2 119.63,45.66 123.7,45.66 124.71,44.64 130.05,44.64 131.06,45.66 B06.E2 | B02.R2 178.82,16.95 174.5,16.95 173.74,16.19 169.93,16.19 154.69,31.43 143,31.43 141.99,30.42 B05.L2
  Bottom 0.254: B05.L2 141.99,30.42 143.51,30.42 145.8,32.7 145.8,33.97 134.11,45.66 132.33,45.66 B06.E2
BAC11
  Top 0.254: 132.84,38.29 132.08,39.05 B06.H2 | 132.84,38.29 133.1,38.04 133.1,23.56 140.97,15.68 140.97,11.87 B05.T2 | 132.84,38.29 124.71,38.29 123.7,39.31 119.63,39.31 B07.H2
  Bottom 0.254: B02.M2 182.12,26.35 182.12,22.29 180.59,20.76 180.59,10.35 180.09,9.84 143,9.84 141.99,10.86 B05.T2
BMB3
  Top 0.254: B11.E2 68.83,45.66 72.9,45.66 73.91,44.64 79.25,44.64 80.26,45.66 B10.E2 | A09.K2 94.23,102.81 98.3,102.81 99.31,101.79 130.05,101.79 131.06,102.81 A08.K2
  Bottom 0.254: B10.E2 81.28,46.67 81.28,50.74 88.65,58.1 88.65,75.63 95.5,82.49 95.5,90.61 94.23,91.88 85.09,91.88 79.25,86.04 77.22,86.04 76.45,86.8 76.45,88.07 91.19,102.81 92.96,102.81 A09.K2
BMB4
  Top 0.254: B11.H2 68.83,39.31 72.9,39.31 73.91,38.29 79.25,38.29 80.26,39.31 B10.H2 | A09.P2 94.23,90.87 98.3,90.87 99.31,91.88 130.05,91.88 131.06,90.87 A08.P2
  Bottom 0.254: B11.H2 68.58,40.32 68.58,44.39 88.14,63.94 88.14,75.88 95,82.74 95,85.79 93.98,86.8 93.98,89.85 A09.P2
BMB5
  Top 0.254: B11.K2 68.83,32.96 72.9,32.96 73.91,31.94 79.25,31.94 80.26,32.96 B10.K2 | A09.T2 91.19,80.71 95.25,80.71 96.77,79.18 126.75,79.18 128.02,80.45 A08.T2
  Bottom 0.254: B11.K2 67.82,33.97 67.82,38.04 67.06,38.8 67.06,55.56 90.17,78.68 90.17,80.2 A09.T2
BMB6
  Top 0.254: B11.M2 68.83,26.61 72.9,26.61 73.91,25.59 79.25,25.59 80.26,26.61 B10.M2 81.28,27.62 81.28,31.69 91.69,42.1 91.69,48.96 | 91.69,48.96 95.25,48.96 96.27,47.94 101.85,47.94 102.62,48.7 B08.D2 | 91.69,48.96 91.19,48.96 B09.D2
BMB7
  Top 0.254: B11.P2 68.83,20.26 72.9,20.26 73.91,19.24 79.25,19.24 80.26,20.26 B10.P2 81.28,21.27 81.28,24.57 96.01,39.31 | 96.01,39.31 98.3,39.31 99.31,38.29 104.65,38.29 105.66,39.31 B08.H2 | 96.01,39.31 94.23,39.31 B09.H2
BMB8
  Top 0.254: B11.S2 68.83,13.91 72.9,13.91 73.91,12.89 79.25,12.89 80.26,13.91 B10.S2 81.53,14.67 83.31,14.67 95.25,26.61 | 95.25,26.61 98.3,26.61 99.31,25.59 104.65,25.59 105.66,26.61 B08.M2 | 95.25,26.61 94.23,26.61 B09.M2
CLRAC
  Top 0.254: B14.P2 30.73,20.26 34.8,20.26 35.81,19.24 41.15,19.24 42.16,20.26 B13.P2
  Bottom 0.254: A05.P2 144.78,89.85 144.78,85.79 155.19,75.37 155.19,29.4 129.29,3.49 61.98,3.49 45.21,20.26 43.43,20.26 B13.P2
DPI
  Bottom 0.254: B03.E2 169.16,46.42 167.64,46.42 164.85,49.21 164.85,74.36 155.19,84.01 155.19,110.93 154.18,111.95 A04.F2
DPO
  Top 0.254: B03.P2 170.18,21.27 170.18,23.05 192.79,45.66 194.56,45.66 B01.E2
GND
  pour GND$: 0,0 203.2,0 203.2,133.35 0,133.35
IC04
  Top 0.254: A13.M2 42.16,96.46 38.1,96.46 37.08,95.44 31.75,95.44 30.73,96.46 A14.M2
  Bottom 0.254: B15.H2 17.02,40.32 17.02,44.39 12.95,48.45 12.95,56.83 18.8,62.67 18.8,80.71 12.95,86.55 12.95,87.82 14.22,89.09 20.32,89.09 27.69,96.46 29.46,96.46 A14.M2
IC05
  Top 0.254: 28.45,89.09 20.32,89.09 12.95,81.72 12.95,65.72 9.91,62.67 9.91,51.5 13.97,47.43 13.97,43.62 B15.F2 | 28.45,89.09 29.46,90.11 A14.P2 | 28.45,89.09 37.08,89.09 38.1,90.11 42.16,90.11 A13.P2
IC06
  Top 0.254: A13.S2 42.16,83.76 38.1,83.76 37.08,82.74 31.75,82.74 30.73,83.76 A14.S2
  Bottom 0.254: B15.E2 17.78,46.67 17.78,50.74 28.96,61.91 28.96,82.74 29.72,83.5 A14.S2
IC07
  Top 0.254: A13.T2 39.12,80.45 34.8,80.45 34.04,79.69 28.7,79.69 27.69,80.71 A14.T2
  Bottom 0.254: B15.D2 14.48,49.97 14.48,53.78 25.65,64.96 25.65,79.18 26.67,80.2 A14.T2
IC08
  Top 0.254: A15.T2 14.99,80.71 18.8,80.71 24.38,75.12 26.42,75.12 A14.V2 27.69,74.36 28.7,73.34 34.04,73.34 34.8,74.1 39.12,74.1 A13.V2
IC09
  Top 0.254: B14.D2 27.69,48.96 31.75,48.96 32.77,47.94 38.35,47.94 39.12,48.7 B13.D2
  Bottom 0.254: A15.U2 17.02,77.15 17.02,61.66 12.45,57.09 12.45,46.67 16.26,42.86 16.26,38.8 16.76,38.29 18.03,38.29 26.67,46.93 26.67,48.45 B14.D2
IC10
  Top 0.254: B13.E2 42.16,45.66 41.15,44.64 35.81,44.64 34.8,45.66 30.73,45.66 B14.E2 29.46,46.42 28.45,47.43 19.81,47.43 12.45,54.8 12.45,56.32 13.97,57.85 13.97,73.85 A15.V2
IC11
  Top 0.254: B14.H2 30.73,39.31 34.8,39.31 35.81,38.29 41.15,38.29 42.16,39.31 B13.H2
  Bottom 0.254: A15.R2 14.99,87.06 19.05,87.06 20.57,85.53 30.73,85.53 31.5,84.77 31.5,41.34 30.48,40.32 B14.H2
INT
  Top 0.254: B14.M2 30.73,26.61 34.8,26.61 35.81,25.59 41.15,25.59 42.16,26.61 B13.M2
  Bottom 0.254: 45.72,89.6 53.59,81.72 53.59,39.81 43.18,29.4 43.18,27.62 B13.M2 | 45.72,89.6 37.08,98.23 28.7,98.23 21.34,90.87 18.03,90.87 A15.P2 | 45.72,89.6 76.96,120.84 116.08,120.84 136.4,100.52 140.72,100.52 A05.L2
IOP1
  Top 0.254: A11.D2 65.79,118.81 69.85,118.81 70.87,117.79 76.45,117.79 77.22,118.55 A10.D2 | B07.K2 119.63,32.96 123.7,32.96 124.71,31.94 130.05,31.94 131.06,32.96 B06.K2
  Bottom 0.254: A10.D2 78.49,118.81 80.77,118.81 149.35,50.23 149.35,29.91 145.03,25.59 141.48,25.59 134.11,32.96 132.33,32.96 B06.K2
IOP2
  Top 0.254: B07.M2 119.63,26.61 123.7,26.61 124.71,25.59 130.05,25.59 131.06,26.61 B06.M2 | A11.K2 68.83,102.81 72.9,102.81 73.91,101.79 79.25,101.79 80.26,102.81 A10.K2
  Bottom 0.254: B07.M2 118.36,27.37 114.3,27.37 113.28,28.38 71.12,28.38 63.75,35.75 63.75,84.01 80.52,100.77 80.52,102.55 A10.K2
IOP4
  Top 0.254: A11.R2 65.79,87.06 69.85,87.06 70.87,86.04 76.45,86.04 77.22,86.8 A10.R2 | B07.P2 119.63,20.26 123.7,20.26 124.71,19.24 130.05,19.24 131.06,20.26 B06.P2
  Bottom 0.254: A10.R2 78.49,87.57 80.01,87.57 84.84,92.39 94.49,92.39 98.04,88.84 98.04,50.74 120.9,27.88 120.9,22.8 119.38,21.27 B07.P2
IOSKP
  Top 0.254: B14.K2 30.73,32.96 34.8,32.96 35.81,31.94 41.15,31.94 42.16,32.96 B13.K2
  Bottom 0.254: B14.K2 29.72,32.7 28.96,31.94 28.96,23.81 14.99,9.84 13.46,9.84 3.05,20.26 3.05,84.52 11.68,93.15 13.72,93.15 A15.N2 14.99,93.92 16.51,93.92 21.34,98.74 53.09,98.74 77.98,123.63 132.33,123.63 136.4,119.57 140.72,119.57 A05.D2
IOTXY2
  Top 0.254: A12.J2 53.09,106.11 56.9,106.11 62.48,100.52 64.52,100.52 A11.L2
  Bottom 0.254: A15.D2 14.48,118.3 14.48,114.49 16.26,112.71 16.26,108.65 17.27,107.63 51.05,107.63 51.82,106.87 A12.J2
IOTXY4
  Top 0.254: A11.S2 67.56,83.76 63.5,83.76 61.98,82.23 54.1,82.23 53.09,81.22 A12.T2
  Bottom 0.254: B15.T2 14.48,11.87 14.48,15.68 28.45,29.65 28.45,36 50.55,58.1 50.55,78.68 52.07,80.2 A12.T2
IOTXZ2
  Top 0.254: A05.U2 144.02,77.15 144.02,75.37 141.99,73.34 138.18,73.34 129.29,82.23 93.47,82.23 77.98,97.73 77.98,99.25 A10.L2
  Bottom 0.254: A12.S2 56.13,84.52 60.2,84.52 75.18,99.5 77.22,99.5 A10.L2
IOTXZ4
  Top 0.254: A10.S2 80.52,84.77 80.52,86.55 68.83,98.23 57.15,98.23 56.13,97.22 A12.M2 55.12,96.2 54.36,95.44 54.36,87.31 39.88,72.83 29.46,72.83 16,59.37 16,59.12 12.95,56.07 12.95,55.05 13.72,54.29 132.59,54.29 140.46,46.42 143.76,46.42 B05.E2
N$1
  Top 0.254: A10.V2 78.49,74.87 80.77,77.15 A10.U2
N$2
  Top 0.254: A16.H2 4.06,109.92 1.78,112.2 A16.F2
N$3  (1 unrouted)
  Top 0.254: A16.R2 1.78,88.07 1.78,91.88 2.79,92.9 2.79,98.23 1.78,99.25 A16.L2
N$4  (1 unrouted)
  Top 0.254: A16.U2 4.06,78.17 1.78,80.45 A16.T2
N$5
  Top 0.254: A10.J2 78.49,106.62 80.77,108.9 A10.H2
N$6
  Top 0.254: B04.H2 156.46,40.07 154.18,42.35 B04.F2
N$7  (1 unrouted)
  Top 0.254: B04.R2 153.67,18.22 153.67,22.29 152.65,23.3 152.65,28.38 153.67,29.4 B04.L2
N$8  (1 unrouted)
  Top 0.254: B04.U2 156.46,8.32 154.18,10.6 B04.T2
N$9
  Top 0.254: A11.V2 65.79,74.87 68.07,77.15 A11.U2
N$10
  Top 0.254: A11.J2 65.79,106.62 68.07,108.9 A11.H2
N$11
  Top 0.254: A10.N2 77.98,92.9 80.26,90.61 A10.P2
N$12
  Top 0.254: A11.N2 65.28,92.9 67.56,90.61 A11.P2
N$13
  Top 0.254: A04.S2 156.72,84.77 156.72,89.85 A04.P2
N$14
  Top 0.254: A04.V2 153.67,75.37 153.67,79.44 152.65,80.45 152.65,85.53 153.67,86.55 A04.R2
N$15  (1 unrouted)
N$16
  Top 0.254: B01.H2 194.56,40.07 192.28,42.35 B01.F2
N$17  (1 unrouted)
PSM  (1 unrouted)
  Top 0.254: 153.67,117.79 153.67,118.3 A04.D2 | 153.67,117.79 153.67,116.78 146.81,109.92 145.03,109.92 A05.H2 | 153.67,117.79 161.04,117.79 167.89,124.65 167.89,126.17 167.39,126.68 156.97,126.68 155.96,127.7 155.96,129.48 157.23,130.75 169.67,130.75 199.64,100.77 199.64,61.15 192.79,54.29 188.72,54.29 174.5,40.07 170.43,40.07 B03.H2
RCLO
  Top 0.254: 4.06,114.49 1.78,116.78 1.78,118.3 A16.D2 | 4.06,114.49 6.1,112.46 6.1,95.44 3.05,92.39 3.05,82.49 6.1,79.44 6.1,77.15 3.05,74.1 3.05,32.96 17.02,18.99 17.02,14.92 B15.S2 | 4.06,114.49 43.43,114.49 47.5,118.55 51.82,118.55 A12.D2
RRE
  Top 0.254: B15.L2 14.99,30.42 18.8,30.42 29.46,41.08 80.26,41.08 89.66,50.48 131.57,50.48 137.92,44.13 150.62,44.13 167.39,27.37 169.16,27.37 B03.M2
TCLO
  Top 0.254: B05.D2 141.99,48.96 146.05,48.96 147.07,47.94 152.65,47.94 153.42,48.7 B04.D2
  Bottom 0.254: A12.U2 55.12,78.42 55.12,82.49 54.36,83.25 54.36,93.66 76.45,115.76 76.45,119.57 77.22,120.33 80.77,120.33 151.38,49.72 153.42,49.72 B04.D2
TSO  (1 unrouted)
  Top 0.254: A15.F2 13.97,111.95 13.97,108.14 6.6,100.77 6.6,88.07 3.56,85.03 3.56,82.74 6.6,79.69 6.6,71.31 3.56,68.26 3.56,51.5 13.46,41.59 61.72,41.59 71.12,50.99 135.13,50.99 141.48,44.64 160.02,44.64 164.08,48.7 166.12,48.7 B03.D2
  Bottom 0.254: B03.D2 167.39,48.96 171.45,48.96 172.47,47.94 190.75,47.94 191.52,48.7 B01.D2
VCC
  Top 0.508: A16.A2 5.33,128.21 9.4,128.21 10.41,127.19 15.75,127.19 16.76,128.21 A15.A2 18.03,128.21 22.1,128.21 23.11,127.19 55.56,127.19 | 79.38,127.32 80.26,128.21 A10.A2 | 79.38,127.32 79.25,127.19 73.91,127.19 72.9,128.21 68.83,128.21 A11.A2 67.56,128.21 66.55,127.19 55.56,127.19 | A05.A2 143.76,128.21 139.95,128.21 138.94,127.19 79.5,127.19 79.38,127.32 | 66.67,60.01 67.56,59.12 B11.A2 | 66.67,60.01 66.55,60.13 23.11,60.13 22.1,59.12 18.03,59.12 B15.A2 | 66.67,60.01 66.8,60.13 75.44,60.13 76.45,59.12 80.26,59.12 B10.A2 81.53,59.12 85.6,59.12 86.61,60.13 142.75,60.13 143.76,59.12 B05.A2 145.03,58.36 149.1,58.36 150.11,57.34 155.45,57.34 156.46,58.36 B04.A2 157.73,58.36 161.8,58.36 162.81,57.34 168.4,57.34 168.53,57.21 | 168.78,57.47 169.42,58.1 B03.A2 | 168.78,57.47 168.53,57.21 | 168.53,57.21 168.4,57.09 168.4,39.05 169.42,38.04 169.42,33.97 B03.K2 | 168.78,57.47 168.91,57.34 177.04,57.34 178.05,58.36 181.86,58.36 B02.A2 183.13,58.36 184.15,57.34 189.74,57.34 190.75,58.36 194.56,58.36 B01.A2 | A12.A2 55.56,127.19
  Bottom 0.508: 155.57,127.32 156.46,128.21 A04.A2 | 155.57,127.32 155.45,127.19 150.11,127.19 149.1,128.21 145.03,128.21 A05.A2 | 168.4,128.21 165.35,128.21 164.34,127.19 155.7,127.19 155.57,127.32 | 168.4,128.21 169.16,128.21 A03.A2 | 168.4,128.21 168.4,76.14 169.42,75.12 169.42,59.37 B03.A2